# EasyEDA Pro project T113 IoT Station.eprj, board PCB1
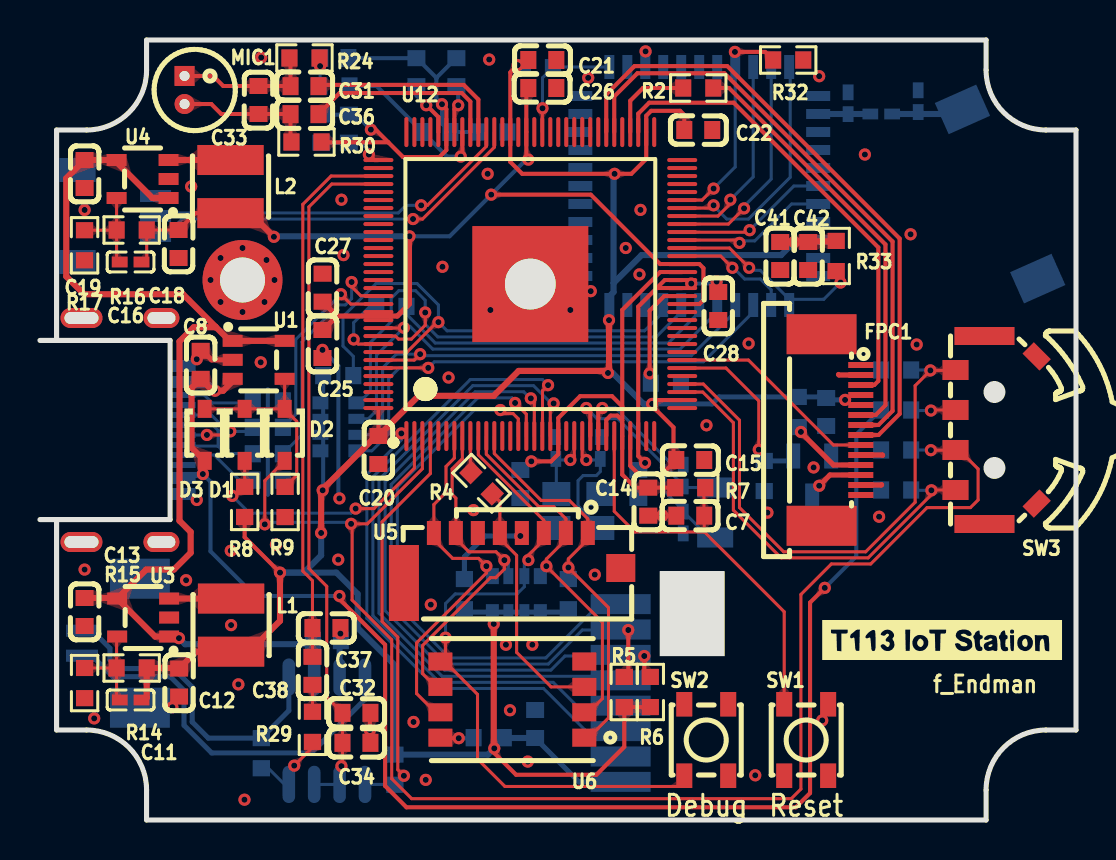
[diagram p3: board, top side]
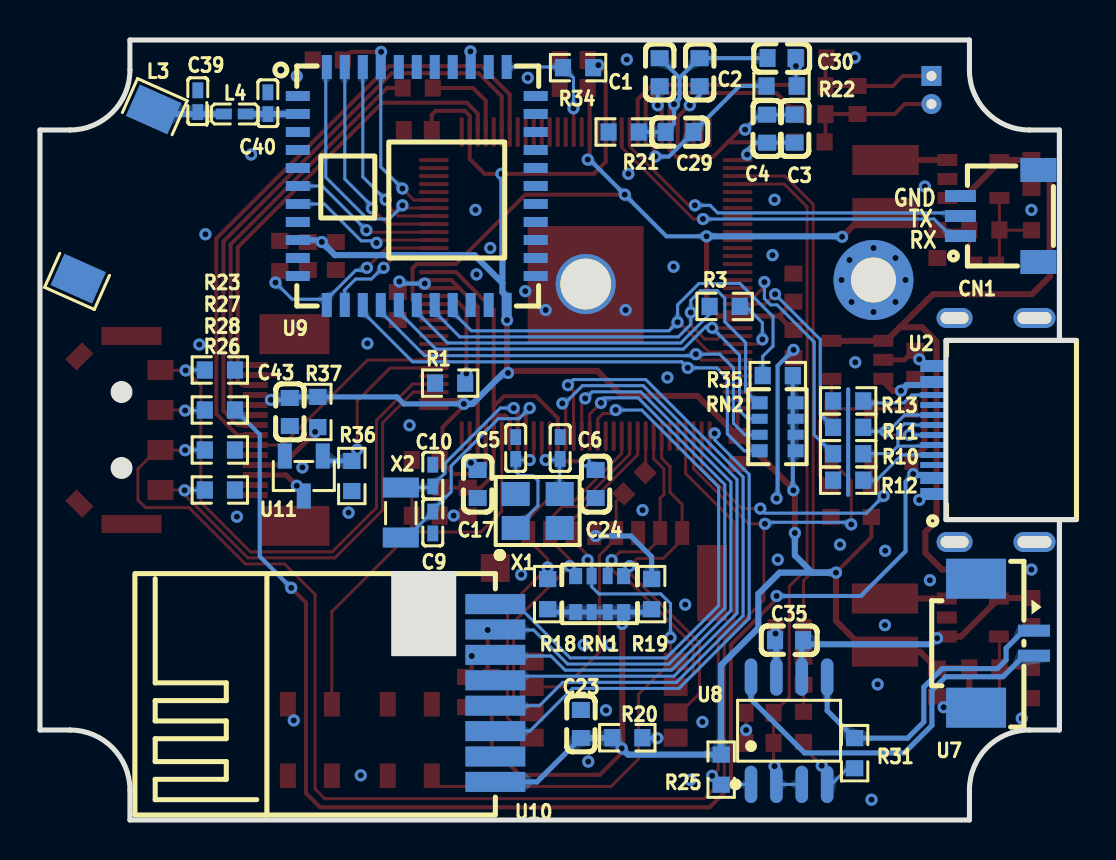
[diagram p4: board, bottom side, seen from below]

Outline 51.83 x 39 mm; copper layers: Top Layer, Bottom Layer. Coordinates in mm from the lower left corner of the outline.
Outline path: 0.83,24 0.83,34.5 2.33,34.5 arc(4.45,35.38) 5.33,37.5 5.33,39 47.33,39 47.33,37.5 arc(48.21,35.38) 50.33,34.5 51.83,34.5 51.83,4.5 50.33,4.5 arc(48.21,3.62) 47.33,1.5 47.33,0 5.33,0 5.33,1.5 arc(4.45,3.62) 2.33,4.5 0.83,4.5 0.83,15
Stack: Top Layer 0.035mm / Dielectric1 1.11mm FR4 er 4.5 / Bottom Layer 0.035mm

## Design rules (mm)
spacing safeClearance (default): track to track 0.152, other pairs 0.076 to 0.3
track width trackWidth (default): min 0.127, default 0.203, max 2.54
track width trackWidthPower: min 0.203, default 0.305, max 2.54
differential pair differentialPair (default): width min 0.127, default 0.254, max 2.54; gap min 0.152, default 0.152
via viaSize (default): diameter min 0.5, default 0.61, max 10; hole min 0.3, default 0.305, max 6
net VCC3.3 uses trackWidthPower
net VCC5 uses trackWidthPower
net VCC5-IN uses trackWidthPower

## Placement (name value [footprint] x y rotation side)
C1  1uF  [C0603]  20.83 37.39 270 bottom
C2  1uF  [C0603]  18.83 37.39 270 bottom
C3  1uF  [C0603]  14.08 34.57 270 bottom
C4  100nF  [C0603]  15.45 34.57 270 bottom
C5  22pF  [C0402]  28.03 18.6 90 bottom
C6  22pF  [C0402]  25.81 18.6 270 bottom
C7  100nF  [C0603]  32.53 15.22 0 top
C8  1uF  [C0603]  8.04 22.76 90 top
C9  22pF  [C0402]  32.18 14.87 270 bottom
C10  22pF  [C0402]  32.18 17.22 90 bottom
C11  22pF  [C0402]  4.53 6 0 top
C12  10uF  [C0603]  6.96 6.87 90 top
C13  10uF  [C0603]  2.23 10.4 270 top
C14  1uF  [C0603]  30.43 15.92 90 top
C15  1uF  [C0603]  32.53 18 180 top
C16  22pF  [C0402]  4.53 27.9 0 top
C17  10uF  [C0603]  29.93 16.8 90 bottom
C18  10uF  [C0603]  6.93 28.8 270 top
C19  10uF  [C0603]  2.23 32.3 270 top
C20  100nF  [C0603]  16.93 18.5 90 top
C21  100nF  [C0603]  25.13 38 180 top
C22  100nF  [C0603]  32.93 34.5 180 top
C23  100nF  [C0603]  24.77 4.8 270 bottom
C24  100nF  [C0603]  24.03 16.8 90 bottom
C25  100nF  [C0603]  14.13 23.8 270 top
C26  100nF  [C0603]  25.13 36.6 0 top
C27  10uF  [C0603]  14.14 26.62 90 top
C28  100nF  [C0603]  33.93 25.7 270 top
C29  1uF  [C0603]  19.83 34.4 0 bottom
C30  10uF  [C0603]  14.73 38.1 0 bottom
C31  100nF  [C0603]  13.23 36.69 180 top
C32  1nF  [C0603]  15.83 5.36 180 top
C33  2.2nF  [C0603]  10.93 36 90 top
C34  1uF  [C0603]  15.83 3.86 180 top
C35  1uF  [C0603]  14.36 8.99 0 bottom
C36  100nF  [C0603]  13.23 35.29 180 top
C37  1nF  [C0603]  14.33 9.6 0 top
C38  100nF  [C0603]  13.63 7.46 270 top
C39  100nF  [C0402]  43.94 35.94 270 bottom
C40  100nF  [C0402]  40.43 35.84 270 bottom
C41  10uF  [C0603]  37.03 28.2 90 top
C42  100nF  [C0603]  38.43 28.2 90 top
C43  100nF  [C0603]  39.33 20.4 270 bottom
CN1  SH1.0-3P  [CONN-SMD_3P-P1.00-L5.0-W5.0]  3.83 30.2 90 bottom
D1  1N5819  [SOD-323_L1.6-W1.3-LS2.7-RD]  10.24 19.26 270 top
D2  1N5819  [SOD-323_L1.6-W1.3-LS2.7-RD]  12.24 19.26 270 top
D3  1N5819  [SOD-323_L1.6-W1.3-LS2.7-RD]  8.24 19.26 270 top
FPC1  14P  [FPC-SMD_14P-P0.50_HDGC_0.5K-AS-14PWB]  40.08 19.5 270 top
L1  2.2uH  [IND-SMD_L3.0-W3.0]  9.56 9.74 270 top
L2  2.2uH  [IND-SMD_L3.0-W3.0]  9.53 31.67 270 top
L3  AN9520-245  [ANT-SMD_L9.5-W2.1]  48.03 31.3 294 bottom
L4  2.2nH  [L0402-RD]  42.09 35.3 180 bottom
MIC1  QSY4015  [MIC-TH_BD4.0-P1.40-D0.3-L]  7.23 36.5 90 top
NOREF  -  [Pad_e11406]  10.13 27 0 top
R1  220R  [R0603]  31.31 21.84 180 bottom
R2  10K  [R0603]  32.93 36.6 180 top
R3  33R  [R0603]  17.58 25.68 180 bottom
R4  33R  [R0603]  22.09 16.84 135 top
R5  47K  [R0603]  29.23 6.4 90 top
R6  47K  [R0603]  30.53 6.4 90 top
R7  10K  [R0603]  32.53 16.62 180 top
R8  10K  [R0603]  10.24 15.9 270 top
R9  200K  [R0603]  12.26 15.9 90 top
R10  90R  [R0603]  11.4 18.31 180 bottom
R11  90R  [R0603]  11.4 19.63 180 bottom
R12  5.1K  [R0603]  11.4 16.99 180 bottom
R13  5.1K  [R0603]  11.4 20.95 0 bottom
R14  150K  [R0603]  4.59 7.6 0 top
R15  33K  [R0603]  2.23 6.85 90 top
R16  100K  [R0603]  4.59 29.5 0 top
R17  200K  [R0603]  2.23 28.74 90 top
R18  47K  [R0603]  26.43 11.29 90 bottom
R19  0R  [R0603]  21.23 11.29 90 bottom
R20  0R  [R0603]  22.45 4.11 0 bottom
R21  0R  [R0603]  22.63 34.4 180 bottom
R22  33R  [R0603]  14.73 36.7 180 bottom
R23  200K  [R0603]  42.83 22.5 0 bottom
R24  1K  [R0603]  13.23 38.1 0 top
R25  10K  [R0603]  17.75 2.52 90 bottom
R26  200K  [R0603]  42.83 16.5 0 bottom
R27  100K  [R0603]  42.83 20.5 180 bottom
R28  200K  [R0603]  42.83 18.5 0 bottom
R29  10K  [R0603]  13.63 4.66 270 top
R30  1K  [R0603]  13.33 33.9 0 top
R31  10K  [R0603]  11.08 3.34 270 bottom
R32  47K  [R0603]  37.43 38 0 top
R33  47K  [R0603]  39.83 28.2 270 top
R34  47K  [R0603]  24.91 37.62 180 bottom
R35  47K  [R0603]  14.92 22.22 0 bottom
R36  10K  [R0603]  36.23 17.2 270 bottom
R37  3R9  [R0603]  37.93 20.4 270 bottom
RN1  47K  [RES-ARRAY-SMD_0603-8P-L3.2-W1.6-BL]  23.83 11.29 180 bottom
RN2  47K  [RES-ARRAY-SMD_0603-8P-L3.2-W1.6-BL]  14.93 19.66 90 bottom
SW1  Reset  [SW-SMD_4P-L3.5-W3.4-P2.20-LS4.2]  38.33 4 90 top
SW2  Debug  [SW-SMD_4P-L3.5-W3.4-P2.20-LS4.2]  33.33 4 270 top
SW3  TM-2023  [SW-SMD_TM-2023-1]  47.83 19.5 270 top
U1  SGM2554AYN5G/TR  [SOT-23-5_L3.0-W1.7-P0.95-LS2.8-BR]  10.94 23.01 180 top
U2  USB-Type-C  [USB-C-SMD_KH-TYPE-C-CB.W-16P]  4.63 19.5 90 bottom
U3  SY8088AAC  [SOT-23-5_L3.0-W1.7-P0.95-LS2.8-BR]  5.16 10.12 0 top
U4  SY8088AAC  [SOT-23-5_L3.0-W1.7-P0.95-LS2.8-BR]  5.13 32.05 0 top
U5  TF-Short-Debug  [TF-SMD_TF-021B-H265-C9900005422]  23.63 13.1 0 top
U6  CSNPxxG  [LGA-8_L8.0-W6.2-TL]  23.63 6.02 180 top
U7  Speaker  [CONN-SMD_2P-P1.25_HANBO_WAFER-125W-2A]  3.55 8.84 270 bottom
U8  FM8002A  [SOP-8_L4.9-W3.9-P1.27-LS6.0-BL]  14.35 4.46 180 bottom
U9  BL-R8723RD2  [WIFIM-SMD_44P-L12.0-W12.0-P0.90]  32.98 31.7 180 bottom
U10  NF-04-MI-2.4G  [WIRELM-SMD_NF-04-MI-2.4G]  29.05 6.35 90 bottom
U11  AO3400  [SOT-23-3_L2.9-W1.3-P1.90-LS2.4-BL-2]  38.63 17.2 0 bottom
U12  -  [eLQFP-128-5.8]  24.53 26.8 0 top
X1  3225-24M  [CRYSTAL-SMD_4P-L3.2-W2.5-BL_SIT8008BI]  26.93 15.45 180 bottom
X2  3215-32.768K  [CRYSTAL-SMD_L3.2-W1.5-FC-135R32.7680KF-A3]  33.78 15.37 270 bottom

## Footprints (pads in the part's own frame, mm; a bottom-side part is the same pattern mirrored in y, then rotated)
ANT-SMD_L9.5-W2.1
  rect 1.71x2.268 smd: 1(-4.63,0) 2(4.63,0)
C0402
  rect 0.79x0.54 smd: 1(-0.545,0) 2(0.545,0)
C0603
  rect 0.8x0.9 smd: 1(-0.7,0) 2(0.7,0)
CONN-SMD_2P-P1.25_HANBO_WAFER-125W-2A
  rect 0.6x1.6 smd: 1(-0.625,1.45) 2(0.625,1.45)
  rect 2x3 smd: 3(3.225,-1.45) 4(-3.225,-1.45)
CONN-SMD_3P-P1.00-L5.0-W5.0
  rect 1.2x1.8 smd: 0(-2.3,-1.95) 0(2.3,-1.95)
  rect 0.6x1.55 smd: 1(-1,1.95) 2(0,1.95) 3(1,1.95)
CRYSTAL-SMD_4P-L3.2-W2.5-BL_SIT8008BI
  rect 1.4x1.2 smd: 1(-1.1,-0.85) 2(1.1,-0.85) 3(1.1,0.85) 4(-1.1,0.85)
CRYSTAL-SMD_L3.2-W1.5-FC-135R32.7680KF-A3
  rect 1x1.8 smd: 1(-1.25,0) 2(1.25,0)
eLQFP-128-5.8
  oval 0.2x1.5 smd: 1(-6.2,-7.599) 2(-5.8,-7.599) 3(-5.4,-7.599) 4(-5,-7.599) 5(-4.6,-7.599) 6(-4.2,-7.599) 7(-3.8,-7.599) 8(-3.4,-7.599) 9(-2.999,-7.599) 10(-2.6,-7.599) 11(-2.2,-7.599) 12(-1.8,-7.599) 13(-1.399,-7.599) 14(-1,-7.599) 15(-0.6,-7.599) 16(-0.2,-7.599) 17(0.2,-7.599) 18(0.6,-7.599) 19(1,-7.599) 20(1.399,-7.599) 21(1.8,-7.599) 22(2.2,-7.599) 23(2.6,-7.599) 24(2.999,-7.599) 25(3.4,-7.599) 26(3.8,-7.599) 27(4.2,-7.599) 28(4.6,-7.599) 29(5,-7.599) 30(5.4,-7.599) 31(5.8,-7.599) 32(6.2,-7.599) 65(6.2,7.599) 66(5.8,7.599) 67(5.4,7.599) 68(5,7.599) 69(4.6,7.599) 70(4.2,7.599) 71(3.8,7.599) 72(3.4,7.599) 73(2.999,7.599) 74(2.6,7.599) 75(2.2,7.599) 76(1.8,7.599) 77(1.399,7.599) 78(1,7.599) 79(0.6,7.599) 80(0.2,7.599) 81(-0.2,7.599) 82(-0.6,7.599) 83(-1,7.599) 84(-1.399,7.599) 85(-1.8,7.599) 86(-2.2,7.599) 87(-2.6,7.599) 88(-2.999,7.599) 89(-3.4,7.599) 90(-3.8,7.599) 91(-4.2,7.599) 92(-4.6,7.599) 93(-5,7.599) 94(-5.4,7.599) 95(-5.8,7.599) 96(-6.2,7.599)
  oval 1.5x0.2 smd: 33(7.599,-6.2) 34(7.599,-5.8) 35(7.599,-5.4) 36(7.599,-5) 37(7.599,-4.6) 38(7.599,-4.2) 39(7.599,-3.8) 40(7.599,-3.4) 41(7.599,-2.999) 42(7.599,-2.6) 43(7.599,-2.2) 44(7.599,-1.8) 45(7.599,-1.399) 46(7.599,-1) 47(7.599,-0.6) 48(7.599,-0.2) 49(7.599,0.2) 50(7.599,0.6) 51(7.599,1) 52(7.599,1.399) 53(7.599,1.8) 54(7.599,2.2) 55(7.599,2.6) 56(7.599,2.999) 57(7.599,3.4) 58(7.599,3.8) 59(7.599,4.2) 60(7.599,4.6) 61(7.599,5) 62(7.599,5.4) 63(7.599,5.8) 64(7.599,6.2) 97(-7.599,6.2) 98(-7.599,5.8) 99(-7.599,5.4) 100(-7.599,5) 101(-7.599,4.6) 102(-7.599,4.2) 103(-7.599,3.8) 104(-7.599,3.4) 105(-7.599,2.999) 106(-7.599,2.6) 107(-7.599,2.2) 108(-7.599,1.8) 109(-7.599,1.399) 110(-7.599,1) 111(-7.599,0.6) 112(-7.599,0.2) 113(-7.599,-0.2) 114(-7.599,-0.6) 115(-7.599,-1) 116(-7.599,-1.399) 117(-7.599,-1.8) 118(-7.599,-2.2) 119(-7.599,-2.6) 120(-7.599,-2.999) 121(-7.599,-3.4) 122(-7.599,-3.8) 123(-7.599,-4.2) 124(-7.599,-4.6) 125(-7.599,-5) 126(-7.599,-5.4) 127(-7.599,-5.8) 128(-7.599,-6.2)
  round 3 hole 2.54: 129(0,0)
  rect 5.8x5.8 smd: 129(0,0)
FPC-SMD_14P-P0.50_HDGC_0.5K-AS-14PWB
  rect 0.3x1.25 smd: 1(-3.25,0.982) 2(-2.75,0.982) 3(-2.25,0.982) 4(-1.75,0.982) 5(-1.25,0.982) 6(-0.75,0.982) 7(-0.25,0.982) 8(0.25,0.982) 9(0.75,0.982) 10(1.25,0.982) 11(1.75,0.982) 12(2.25,0.982) 13(2.75,0.982) 14(3.25,0.982)
  rect 2x3.5 smd: 15(4.79,-0.982) 16(-4.79,-0.982)
IND-SMD_L3.0-W3.0
  rect 1.501x3.32 smd: 1(1.329,0) 2(-1.329,0)
L0402-RD
  rect 0.79x0.54 smd: 1(-0.545,0) 2(0.545,0)
LGA-8_L8.0-W6.2-TL
  rect 1.2x0.9 smd: 1(-3.6,1.905) 2(-3.6,0.635) 3(-3.6,-0.635) 4(-3.6,-1.905) 5(3.6,-1.905) 6(3.6,-0.635) 7(3.6,0.635) 8(3.6,1.905)
MIC-TH_BD4.0-P1.40-D0.3-L
  rect 1.001x1.001 hole 0.5: 1(0.701,0)
  round 1.001 hole 0.5: 2(-0.701,0)
Pad_e11406
  round 4 hole 2.25: 1(0,0)
R0603
  rect 0.806x0.864 smd: 1(-0.753,0) 2(0.753,0)
RES-ARRAY-SMD_0603-8P-L3.2-W1.6-BL
  rect 0.65x0.8 smd: 1(-1.2,-0.9) 4(1.2,-0.9) 5(1.2,0.9) 8(-1.2,0.9)
  rect 0.5x0.8 smd: 2(-0.4,-0.9) 3(0.4,-0.9) 6(0.4,0.9) 7(-0.4,0.9)
SOD-323_L1.6-W1.3-LS2.7-RD
  rect 0.899x0.701 smd: 1(-1.3,0) 2(1.3,0)
SOP-8_L4.9-W3.9-P1.27-LS6.0-BL
  oval 0.63x1.865 smd: 1(-1.905,-2.683) 2(-0.635,-2.683) 3(0.635,-2.683) 4(1.905,-2.683) 5(1.905,2.683) 6(0.635,2.683) 7(-0.635,2.683) 8(-1.905,2.683)
SOT-23-3_L2.9-W1.3-P1.90-LS2.4-BL-2
  rect 0.7x1.25 smd: 1(-0.95,-1) 2(0.95,-1) 3(0,1)
SOT-23-5_L3.0-W1.7-P0.95-LS2.8-BR
  rect 1x0.6 smd: 1(1.3,-0.95) 2(1.3,0) 3(1.3,0.95) 4(-1.3,0.95) 5(-1.3,-0.95)
SW-SMD_4P-L3.5-W3.4-P2.20-LS4.2
  rect 1.224x0.8 smd: 1(-1.788,1.1) 2(1.788,1.1) 3(-1.788,-1.1) 4(1.788,-1.1)
SW-SMD_TM-2023-1
  rect 1x1.3 smd: 1(-3,-2.03) 2(3,-2.03) C(-1,-2.03) T(1,-2.03)
  rect 0.9x3 smd: 3(-4.7,-0.58) 4(4.7,-0.58)
  rect 1.2x0.8 smd rot 135: 5(3.68,2.03)
  rect 1.2x0.8 smd rot 45: 6(-3.68,2.03)
TF-SMD_TF-021B-H265-C9900005422
  rect 0.7x1.2 smd: 1(3.775,1.25) 2(2.675,1.25) 3(1.575,1.25) 4(0.475,1.25) 5(-0.625,1.25) 6(-1.725,1.25) 7(-2.825,1.25) 8(-3.925,1.25)
  rect 1.5x3.8 smd: 9(-5.425,-1.25)
  rect 1.45x1.4 smd: 10(5.425,-0.5)
USB-C-SMD_KH-TYPE-C-CB.W-16P
  oval 1x1.8 hole 0.6x1.4: 17(5.6,1.444) 20(-5.6,1.443)
  oval 1x2.1 hole 0.6x1.7: 18(5.6,-2.557) 19(-5.6,-2.557)
  rect 0.3x1.2 smd: A1(-3.35,2.557) A4(-2.55,2.557) A5(-1.25,2.557) A6(-0.25,2.557) A7(0.25,2.557) A8(1.25,2.557) A9(2.55,2.557) A12(3.35,2.557) B1(3.05,2.557) B4(2.25,2.557) B5(1.75,2.557) B6(0.75,2.557) B7(-0.75,2.557) B8(-1.75,2.557) B9(-2.25,2.557) B12(-3.05,2.557)
WIFIM-SMD_44P-L12.0-W12.0-P0.90
  rect 1.2x0.5 smd: 1(-5.95,4.5) 2(-5.95,3.6) 3(-5.95,2.7) 4(-5.95,1.8) 5(-5.95,0.9) 6(-5.95,0) 7(-5.95,-0.9) 8(-5.95,-1.8) 9(-5.95,-2.7) 10(-5.95,-3.6) 11(-5.95,-4.5) 23(5.95,-4.5) 24(5.95,-3.6) 25(5.95,-2.7) 26(5.95,-1.8) 27(5.95,-0.9) 28(5.95,0) 29(5.95,0.9) 30(5.95,1.8) 31(5.95,2.7) 32(5.95,3.6) 33(5.95,4.5)
  rect 0.5x1.2 smd: 12(-4.5,-5.95) 13(-3.6,-5.95) 14(-2.7,-5.95) 15(-1.8,-5.95) 16(-0.9,-5.95) 17(0,-5.95) 18(0.9,-5.95) 19(1.8,-5.95) 20(2.7,-5.95) 21(3.6,-5.95) 22(4.5,-5.95) 34(4.5,5.95) 35(3.6,5.95) 36(2.7,5.95) 37(1.8,5.95) 38(0.9,5.95) 39(0,5.95) 40(-0.9,5.95) 41(-1.8,5.95) 42(-2.7,5.95) 43(-3.6,5.95) 44(-4.5,5.95)
WIRELM-SMD_NF-04-MI-2.4G
  rect 1x3 smd: 1(-4.445,-0.002) 2(-3.175,-0.002) 3(-1.905,-0.002) 4(-0.635,-0.002) 5(0.635,-0.002) 6(1.905,-0.002) 7(3.175,-0.002) 8(4.445,0.002)

## Nets
As in the schematic, except:
GND: C5.2 C6.1 C7.1 C8.2 C9.2 C10.2 C12.1 C13.2 C14.1 C15.1 C17.1 C18.2 C19.2 C20.1 C21.1 C22.1 C23.1 C24.1 C25.2 C26.2 C27.2 C28.2 C32.1 C34.1 C35.2 C37.2 C39.1 C40.1 C41.1 C42.1 C43.2 CN1.0 CN1.3 FPC1.2 FPC1.10 FPC1.13 FPC1.15 FPC1.16 NOREF.1 R1.1 R9.1 R12.1 R13.2 R15.1 R17.1 R21.1 R23.1 R26.1 R28.1 R32.2 R36.2 SW1.4 SW2.2 U1.2 U2.17 U2.18 U2.19 U2.20 U2.A1 U2.A12 U2.B1 U2.B12 U3.2 U4.2 U5.6 U5.9 U5.10 U6.4 U7.3 U7.4 U8.7 U9.1 U9.3 U9.20 U9.31 U9.33 U9.36 U10.2 U11.2 U12.129 X1.2 X1.4

Pads without a net: FPC1 1 14; L3 2; SW1 1 3; SW2 1 3; SW3 3 4 5 6; U2 A8 B8; U9 4 5 8 10 11 21 23 24 25 26 27 28 29 30 32 35 37 38 39 40; U12 5 6 13 14 31 32 33 37 40 41 42 43 44 45 60 61 62 63 64 65 69 72 73 74 75 76 77 78 80 82 84 93 94 95 96 98 101 102 103 104 105 106 107 108 109 110 111 112 113 124 125 126 127

## Via types
v1: diameter 0.61, hole 0.305, Top Layer to Bottom Layer, 153 vias

## Routing (per net, layer and track width the routed paths; a pad name or vN(x,y) marks a point on that pad's centre or on a via; arc(x,y) is an arc through that point)
AGND: length 23.6
  Top Layer w0.203: 17.43,33.88 16.79,34.52 v1(16.56,34.52) ; 17.43,33.88 18.16,33.15 19.98,33.15 20.33,33.5 U12.91 20.33,35.54 20.11,35.76 v1(20.11,35.79) ; 17.43,33.88 14.1,33.88 R30.2
  Bottom Layer w0.203: 19.83,37.11 19.83,37.09 19.83,37.08 19.83,36.07 v1(20.11,35.79) 20.11,34.82 C29.2 R21.2 ; 19.83,37.11 19.83,37.11 18.85,38.09 C2.1 15.44,38.09 C30.2 ; 19.83,37.11 20.81,38.09 C1.1 ; 16.56,34.52 15.81,35.27 C4.1 C3.1
AVCC1.8: length 8.3
  Top Layer w0.203: v1(21.05,33.17) 21.13,33.25 U12.89
  Bottom Layer w0.203: v1(21.05,33.17) 20.37,33.17 19.14,34.4 C29.1 19.13,34.41 16.84,36.7 R22.1
GND: length 24.3
  Top Layer w0.203: v1(9.03,28.1) 9.63,28.1 v1(10.13,28.6) ; C14.1 31.13,15.22 v1(31.14,15.22) 31.83,15.22 C7.1 ; C32.1 16.5,5.33 v1(16.5,4.5) 16.5,3.89 C34.1
  Top Layer w0.254: U1.2 8.58,23.01 8.14,23.46 C8.2 ; FPC1.13 42.09,16.75 42.11,16.76 ; FPC1.2 39.97,22.25 39.95,22.28 ; 42.16,18.24 42.15,18.25 FPC1.10
  Bottom Layer w0.203: 11.4,16.26 11.4,21.54 ; v1(14.98,16.08) 14.93,16.08 14.88,16.13 14.93,16.18 14.93,22.71 v1(14.13,23.51)
  Bottom Layer w0.305: U8.7 14.99,8.93 C35.2
  vias: v1(2.23,30.5) v1(2.23,12.52) v1(2.71,5.08) v1(6.62,5.64) v1(7.31,11.99) v1(7.56,31.67) v1(7.84,23.04) v1(7.84,16) v1(8.53,27) v1(9.03,25.9) v1(9.54,13.46) v1(9.56,9.74) v1(9.93,6.78) v1(10.13,25.4) v1(10.23,1.02) v1(11.07,38.13) v1(11.04,22.89) v1(11.23,25.9) v1(11.33,28) v1(11.73,27) v1(11.81,13.77) v1(14.92,13.02) v1(15.08,31.01) v1(15.03,9.32) v1(15.18,28.25) v1(18.69,4.9) v1(19.3,2.01) v1(19.55,10.77) v1(20.14,27.66) v1(20.44,22.12) v1(21.69,15.49) v1(22.47,38.02) v1(22.4,32.31) v1(22.53,25.5) v1(23.31,8.76) v1(23.51,5.49) v1(24.4,2.92) v1(24.63,8.76) v1(26.53,25.5) v1(27.43,37.11) v1(27.55,26.44) v1(27.76,12.27) v1(29.31,28.6) v1(30.04,30.51) v1(29.99,27.28) v1(30.3,38.43) v1(33.34,19.74) v1(35.45,23.83) v1(35.78,2.23) v1(36.39,15.37) v1(38.7,17.63) v1(38.98,37.19) v1(39.14,4.98) v1(41.27,33.27) v1(41.98,15.16) v1(43.56,29.29) v1(43.86,23.77)
VCC1.8: length 24.8
  Top Layer w0.203: U12.50 31.02,27.4 29.13,25.5 29.13,20.68 ; 29.13,20.68 28.62,21.19 27.02,21.19 25.93,20.1 U12.20 25.93,18.3 25.57,17.93 v1(24.58,17.93) ; 29.13,20.68 29.13,19.98 ; 29.13,19.98 U12.28 29.13,17.27 29.79,16.61 30.62,16.62 ; 29.13,19.98 28.89,20.22 28.54,20.22 28.33,20 U12.26 ; 30.62,16.62 C14.2 ; 30.62,16.62 R7.2
  Bottom Layer w0.203: v1(24.58,17.93) 24.47,17.93 C24.2
VCC3.3: length 155.9
  Top Layer w0.203: U12.128 16.93,19.18 16.93,19.17 ; R6.1 R5.1 29.23,3.66 27.83,2.26 23.82,2.26 22.73,3.35 v1(22.73,3.58) ; U12.34 30.82,21 v1(30.63,20.8) 30.63,20.7 31.69,19.63 31.69,18.14 C15.2 31.13,17.3 29.94,17.3 29.53,17.71 U12.29 ; C22.2 32.23,35.25 32.03,35.46 30.58,35.46 30.33,35.21 U12.66 30.33,33.05 29.59,32.31 v1(28.75,32.31) 24.12,32.31 23.53,32.9 U12.83 23.53,37.38 v1(23.9,37.74) ; v1(12.01,12.37) 10.24,14.14 R8.2
  Top Layer w0.254: v1(40.28,21.01) 40.36,21.01
  Top Layer w0.305: v1(14.07,14.35) 14.07,16.46 16.78,19.17 16.93,19.17 C20.2 18.94,21.21 22.7,21.21 23.95,22.45 28.32,22.45 v1(28.42,22.35) 28.47,22.4 v1(28.47,24.99) ; 38.42,28.93 39.48,28.93 39.54,28.99 ; 38.42,28.93 38.42,28.92 C42.2 ; 38.42,28.93 38.39,28.9 v1(37.73,28.9) ; 22.7,9.8 22.7,3.61 v1(22.73,3.58) ; 39.55,28.99 39.55,29 ; 39.55,28.99 39.54,28.99 ; 39.55,28.99 39.56,29 39.55,29 ; 39.55,29 39.54,28.99 ; v1(12.01,12.37) 12.01,9.96 10.47,8.42 L1.1 7.8,8.42 C12.2 6.93,7.6 5.34,7.6 5.34,6.11 5.23,6
  Bottom Layer w0.203: R34.2 24.02,37.62 v1(23.9,37.74) ; v1(14.14,16.48) 14.17,16.51 R35.1
  Bottom Layer w0.254: R19.1 21.38,10.39 RN1.4 ; v1(37.73,28.9) 37.83,29 U9.9 ; v1(30.63,20.8) 33.62,20.8 33.97,21.15 R37.1 39.28,21.15 C43.1 39.43,21.01 v1(40.28,21.01) ; RN1.4 22.7,10.32 v1(22.7,9.8) ; RN1.4 RN1.3 RN1.2 RN1.1 26.29,10.39 R18.1 ; C23.2 26.97,1.91 U10.1
  Bottom Layer w0.305: 28.7,26.85 30.09,28.24 37.08,28.24 v1(37.73,28.9) ; 28.7,26.85 28.7,32.26 v1(28.75,32.31) ; 28.7,26.85 28.7,26.39 28.48,26.18 U9.22 ; 12.01,12.37 13.2,12.37 14.07,13.23 v1(14.07,14.35) ; v1(28.42,22.35) 28.65,22.35 30.2,20.8 v1(30.63,20.8) ; v1(12.01,12.37) 14.83,12.37 15.9,11.3 15.9,9.6 17.75,7.74 R25.2 22.42,3.27 v1(22.73,3.58) 22.73,3.64 R20.2 23.22,4.1 C23.2
VCC5: length 55.4
  Top Layer w0.305: U3.4 3.83,11.1 C13.1 ; U3.4 5.76,9.17 U3.1 6.88,9.17 v1(6.95,9.09) ; U3.4 5.31,12.52 6.7,12.52 7.54,13.36 7.54,14.4 6.98,14.96 6.98,23.93 7.69,24.64 8.76,24.64 8.78,24.66 ; 8.78,24.66 9.49,23.96 12.24,23.96 ; 8.78,24.66 7.16,26.29 2.2,26.29 1.32,27.18 1.32,32.08 C19.1 U4.4 3.83,32.89 5.62,31.1 U4.1
  Bottom Layer w0.254: C35.1 13.72,8.93 U8.6
  Bottom Layer w0.305: C35.1 13.45,8.79 7.26,8.79 v1(6.95,9.09)
VCC5-IN: length 75
  Top Layer w0.203: v1(14.98,11.2) 14.98,11.05 17.27,8.76 17.27,1.7 18.33,0.64 37.82,0.64 38.53,1.35 38.53,10.87 v1(39.26,11.61)
  Top Layer w0.305: 8.15,17.48 8.15,17.86 D3.2 7.58,18.61 7.58,21.6 C8.1 8.63,21.46 9.16,21.46 9.64,21.94 U1.3
  Bottom Layer w0.203: v1(8.15,17.3) 8.53,16.92 8.53,13.44 10.76,11.2 v1(14.98,11.2) ; R27.2 42.06,20.5 40.84,19.28 40.84,13.18 v1(39.26,11.61)
  Bottom Layer w0.254: U2.B9 U2.A4
  Bottom Layer w0.305: U2.B9 8.1,17.25 v1(8.15,17.3) ; v1(8.76,21.46) 8.47,21.75 U2.B4 U2.A9
VCC-CORE: length 50.9
  Top Layer w0.152: 5.23,27.9 5.34,28.01 5.34,29.5 C18.1
  Top Layer w0.203: 24.43,36.5 24.33,36.4 U12.81 24.33,33.12 v1(24.43,33.02) ; 9.53,30.34 7.78,30.34 C18.1 ; v1(22.58,31.27) 27.55,31.27 31.02,27.8 U12.51 32.99,27.8 33.19,27.59 33.19,26 32.99,25.8 U12.46
  Top Layer w0.254: v1(18.49,29.18) 18.49,25.81 17.88,25.2 14.86,25.2 ; C25.1 14.16,24.5 14.86,25.2 ; 14.86,25.2 C27.1
  Top Layer w0.305: v1(11.7,29.16) 10.52,30.34 9.53,30.34
  Bottom Layer w0.203: v1(18.49,29.18) 20.49,29.18 v1(22.58,31.27) 24.33,33.02 v1(24.43,33.02)
  Bottom Layer w0.305: v1(18.49,29.18) 11.73,29.18 v1(11.7,29.16)
VCC-DRAM: length 13.8
  Top Layer w0.203: U12.48 30.86,26.6 ; 30.86,26.6 29.93,25.67 U12.30 29.93,18.2 v1(30.27,17.86) ; 30.86,26.6 31.26,27 U12.49
  Bottom Layer w0.203: v1(30.27,17.86) 30.27,17.84 C17.2 ; v1(32.58,26.82) 33.75,26.82 v1(33.85,26.92)
AMP-PA: length 20.6
  Top Layer w0.152: v1(18.21,2.21) 17.9,2.51 17.9,9.14 17.11,9.93 17.11,14.91 19.53,17.33 U12.4
  Bottom Layer w0.152: v1(18.21,2.21) 18.2,2.21 17.75,1.76 17.74,1.78 U8.1
AP_WAKE_BT: length 7.8
  Top Layer w0.152: v1(35.5,29.49) 35.4,29.39 32.14,29.39 U12.55
  Bottom Layer w0.152: v1(35.5,29.49) 37.71,31.7 U9.6
BT-EN: length 6.3
  Top Layer w0.152: v1(25.14,35.59) 25.13,35.58 U12.79
  Bottom Layer w0.152: v1(25.14,35.59) 25.14,37.11 25.65,37.62 R34.1 25.7,37.65 U9.34
BT_WAKE_AP: length 7.7
  Top Layer w0.152: v1(35,28.85) 34.85,29 U12.54
  Bottom Layer w0.152: v1(35,28.85) 35.1,28.96 35.76,28.96 37.6,30.8 U9.7
DXIN: length 6.8
  Top Layer w0.152: U12.23 27.13,18.2 v1(27.33,18)
  Bottom Layer w0.152: X1.1 26.92,15.71 26.92,16.97 27.17,17.22 27.83,17.22 28.03,17.42 28.03,17.9 ; 27.95,17.9 28.03,17.9 ; 28.03,17.9 28.03,18.06 27.98,18 v1(27.33,18)
DXOUT: length 3.6
  Top Layer w0.152: U12.22 26.73,18.2 v1(26.53,18)
  Bottom Layer w0.152: 25.81,17.9 25.83,17.87 X1.3 ; v1(26.53,18) 25.86,18 25.81,18.06
GPIO-POWER-CTL: length 14.1
  Top Layer w0.152: v1(15.79,15.57) 16.71,15.57 18.73,17.59 U12.2 ; 10.24,17.96 10.24,16.66 9.79,16.2 v1(9.62,16.2)
  Bottom Layer w0.152: v1(15.79,15.57) 15.56,15.34 10.48,15.34 v1(9.62,16.2)
HPOUT-FB: length 33.9
  Top Layer w0.152: v1(15.08,2.69) 15.13,2.74 C34.2 C32.2 14.35,6.15 14.35,11.68 13.45,12.57 13.45,30.66 14.6,31.8 U12.100
  Bottom Layer w0.152: U8.2 U8.3
HPOUT-L: length 27.2
  Top Layer w0.152: C38.1 C37.1 13.63,11.97 13.15,12.45 13.15,30.78 14.56,32.2 U12.99
KEY-L: length 27.9
  Top Layer w0.152: SW3.1 45.78,22.48 v1(44.55,22.48) 43.78,21.72 43.78,15.89 41.31,13.41 37.21,13.41 35,15.62 35,19.99 33.19,21.8 U12.36
  Bottom Layer w0.152: R23.2 44.53,22.5 v1(44.55,22.48)
KEY-POWER: length 74.8
  Top Layer w0.152: v1(44.57,18.49) 45.79,18.49 SW3.T 45.98,18.5 46.93,17.55 46.93,16 46.55,15.62 44.38,15.62 41.56,12.8 39.59,12.8 38.07,11.28 38.07,1.55 37.59,1.07 18.59,1.07 17.6,2.06 17.6,9.02 15.62,11 15.62,14.76 v1(15.56,14.81) 16.38,14.81 19.13,17.56 U12.3 ; v1(11.25,14.78) 11.25,16.96 D2.2
  Bottom Layer w0.152: R28.2 44.56,18.5 v1(44.57,18.49) ; v1(11.25,14.78) 11.35,14.88 15.49,14.88 v1(15.56,14.81)
KEY-R: length 22.2
  Top Layer w0.152: SW3.2 44.61,16.5 v1(44.6,16.48) 44.6,16.27 41.43,13.11 37.08,13.11 34.69,15.49 34.69,19.86 33.16,21.4 U12.35
  Bottom Layer w0.152: R26.2 43.6,16.48 v1(44.6,16.48)
LCD-LED-PWM: length 8.5
  Top Layer w0.152: v1(35.96,18.52) 35.96,20.95 34.32,22.6 U12.38
  Bottom Layer w0.254: R36.1 37.44,17.95 U11.1
LCD-RESET: length 10.7
  Top Layer w0.152: FPC1.9 39.69,18.75 35.44,23 U12.39
MIC-N: length 9.7
  Top Layer w0.203: C36.1 14.99,36.35 21.1,36.35 21.53,35.92 U12.88
MIC-P: length 10
  Top Layer w0.203: U12.87 21.93,36.02 21.2,36.75 14,36.75 C31.1
NRF-CE: length 25
  Bottom Layer w0.152: U10.3 27.32,4.44 25.19,6.58 19.86,6.58 16.35,10.09 16.35,17.28 18.08,19.01 v1(18.08,19.33)
NRF-IRQ: length 28
  Top Layer w0.152: v1(23.03,20.5) 23.21,20.32 23.67,20.32 23.93,20.06 U12.15
  Bottom Layer w0.152: 29.05,10.8 28,10.8 25.31,8.1 20.49,8.1 17.88,10.72 17.88,16.65 21.73,20.5 v1(23.03,20.5)
RESET: length 21.2
  Top Layer w0.152: 33.23,14.4 29.76,14.4 28.73,15.43 U12.27 ; 33.23,14.4 C7.2 33.22,15.23 33.22,16.55 R7.1 ; 33.23,14.4 33.24,14.4 37.23,10.41 SW1.2
SDIO0-CLK: length 12.5
  Top Layer w0.152: R4.1 23.01,15.93 U5.5 23.01,14.07 23.85,13.23 23.85,8.38 25.57,6.66 U6.3
SDIO0-CMD: length 33.7
  Top Layer w0.152: v1(20.29,9.12) 20.29,8.19 20.03,7.93 U6.5 20.25,7.92 21.89,6.28 21.89,3.05 23.26,1.68 32,1.68 32.23,1.91 SW2.4 ; v1(24.43,12.99) 24.43,13.24 25.21,14.01 U5.3 25.21,14.98 21.93,18.26 U12.10
  Bottom Layer w0.152: v1(24.43,12.99) 24.23,12.79 RN1.7 24.23,11.67 23.87,11.3 20.77,11.3 20.29,10.82 v1(20.29,9.12)
SDIO0-D0: length 17.9
  Top Layer w0.152: U12.8 21.13,18.06 20.62,17.55 20.62,16.28 20.81,16.09 U5.7 20.81,14.06 21.46,13.41 22.82,13.41 v1(23.23,12.99) 23.23,12.55 22.8,12.12 22.53,12.12 19.15,8.73 19.15,7.31 19.81,6.66 U6.6
  Bottom Layer w0.152: v1(23.23,12.99) 23.43,12.79 RN1.6
SDIO0-D1: length 18.8
  Top Layer w0.152: U6.7 19.78,5.39 18.84,6.32 18.84,8.86 22.33,12.35 v1(22.33,12.69) 21.95,13.08 20.65,13.08 19.71,14.02 U5.8 19.71,15.78 20.31,16.38 20.31,17.68 20.73,18.09 U12.7
  Bottom Layer w0.152: RN1.5 22.63,12.39 v1(22.33,12.69)
SDIO0-D2: length 20.3
  Top Layer w0.152: U12.12 22.73,18.32 25.07,15.98 26.49,15.98 27.41,15.06 U5.1 27.41,14.03 26.44,13.06 v1(26.44,12.62) 28.44,10.62 28.44,5.11 27.45,4.11 U6.1
  Bottom Layer w0.152: 26.43,12.62 v1(26.44,12.62) 26.44,12.05 R18.2
SDIO0-D3: length 18.6
  Top Layer w0.152: U6.2 27.45,5.39 28.14,6.07 28.14,9.89 v1(25.33,12.69) 25.33,13.04 26.31,14.02 U5.2 26.31,15.06 25.7,15.67 24.95,15.67 22.33,18.29 U12.11
  Bottom Layer w0.152: RN1.8 25.03,12.39 v1(25.33,12.69)
SDIO1-CLK: length 16.8
  Bottom Layer w0.152: U9.17 32.98,25.39 31.44,23.85 19.77,23.85 18.33,25.29 18.33,25.86
SDIO1-CMD: length 24.5
  Top Layer w0.152: U12.118 18.19,24.6 v1(18.21,24.61)
  Bottom Layer w0.152: RN2.6 16.42,20.06 16.84,20.47 16.84,23.24 v1(18.21,24.61) 18.28,24.69 18.5,24.69 19.65,23.55 32.02,23.55 33.88,25.4 U9.16
SDIO1-D0: length 26.5
  Top Layer w0.152: U12.119 17.78,24.2 17.94,24.04 18.58,24.04 19.27,24.74 v1(19.27,25.37)
  Bottom Layer w0.152: U9.18 32.08,25.41 30.83,24.16 19.9,24.16 19.27,24.78 v1(19.27,25.37) 19.27,25.98 18.79,26.47 17.95,26.47 17.57,26.09 17.57,24.92 16.53,23.88 16.53,21.44 15.95,20.86 RN2.5
SDIO1-D1: length 25.7
  Top Layer w0.152: v1(19.93,24.89) 19.86,24.89 18.36,23.4 U12.121
  Bottom Layer w0.152: U9.19 31.18,25.4 30.25,24.46 20.37,24.46 v1(19.93,24.89) 19.93,25.75 18.87,26.82 16.81,26.82 15.16,25.17 15.16,23.7 15.68,23.18 R35.2
SDIO1-D2: length 27.2
  Top Layer w0.152: v1(19.43,22.61) 16.94,22.61 U12.123
  Bottom Layer w0.152: RN2.8 16.6,18.46 17.44,19.3 17.44,22.07 17.98,22.61 v1(19.43,22.61) 19.73,22.91 33.19,22.91 35.68,25.4 U9.14
SDIO1-D3: length 25.8
  Top Layer w0.152: v1(19.02,23.29) 18.72,23 U12.122
  Bottom Layer w0.152: 19.1,23.22 19.12,23.19 ; 19.1,23.22 32.58,23.22 34.78,25.42 U9.15 ; 19.1,23.22 v1(19.02,23.29) 17.83,23.29 17.14,22.61 17.14,19.84 16.56,19.26 RN2.7
SPI0-CS: length 34.8
  Top Layer w0.152: U12.18 25.14,19.21 25.14,21.46 v1(25.42,21.74)
  Bottom Layer w0.152: v1(25.42,21.74) 25.14,22.02 21.53,22.02 16.66,17.15 16.66,10.21 19.99,6.88 25.67,6.88 26.84,5.72 29.05,5.72
SPI0-MISO: length 32.4
  Top Layer w0.152: v1(23.77,20.85) 24.33,20.29 U12.16
  Top Layer w0.203: v1(29.43,9.5) 29.43,7.35 R5.2
  Bottom Layer w0.152: v1(29.43,9.5) 27.13,9.5 25.43,7.8 20.37,7.8 17.57,10.59 17.57,16.77 21.91,21.11 23.62,21.11 23.77,20.95 v1(23.77,20.85)
SPI0-MOSI: length 33.3
  Top Layer w0.152: U12.17 24.73,20.91 v1(24.56,21.08)
  Top Layer w0.203: v1(30.23,8.2) 30.23,7.45 R6.2
  Bottom Layer w0.152: v1(24.56,21.08) 24.53,21.08 24.2,21.41 21.78,21.41 17.27,16.9 17.27,10.47 20.24,7.49 25.56,7.49 26.26,8.2 v1(30.23,8.2)
SPI0-SCK: length 32.9
  Top Layer w0.152: v1(25.7,20.83) 25.53,20.66 U12.19
  Bottom Layer w0.152: U10.5 28.85,7.19 20.11,7.19 16.96,10.34 16.96,17.03 21.65,21.72 24.69,21.72 25.58,20.83 v1(25.7,20.83)
SPI1-DBI-CS: length 23.8
  Top Layer w0.203: FPC1.3 41.74,21.75 41.94,21.95 41.94,28.63 34.71,35.86 30.48,35.86 29.93,35.32 U12.67
SPI1-DBI-DC: length 31.9
  Top Layer w0.203: FPC1.8 41.95,19.25 43.01,20.31 43.01,29.07 34.39,37.69 29.74,37.69 28.33,36.28 U12.71
SPI1-DBI-SCLK: length 21.3
  Top Layer w0.203: FPC1.6 41.81,20.25 42.3,20.74 42.3,28.78 34.47,36.6 33.69,36.6
SPI1-DBI-SDA: length 30
  Top Layer w0.203: U12.70 28.73,36.18 29.89,37.34 34.24,37.34 42.65,28.92 42.65,20.45 41.95,19.75 FPC1.7
UART2-CTX: length 11.2
  Top Layer w0.152: U12.59 33.13,31 v1(33.7,31.57)
  Top Layer w0.203: R32.1 36.27,38.41 v1(34.77,38.41)
  Bottom Layer w0.152: v1(33.7,31.57) 34.78,32.65 U9.41 34.78,38.39 v1(34.77,38.41)
UART2-RTX: length 12.2
  Top Layer w0.152: U12.58 33.56,30.6 v1(33.7,30.73)
  Bottom Layer w0.152: U9.44 37.54,37.6 37.54,32.14 35.45,30.05 34.36,30.05 33.7,30.71 v1(33.7,30.73)
UART2-RX: length 10
  Top Layer w0.152: U12.57 33.92,30.2 34.54,30.82 v1(34.54,31.01)
  Bottom Layer w0.152: U9.42 35.68,32.16 v1(34.54,31.01)
UART2-TX: length 11
  Top Layer w0.152: U12.56 34.44,29.8 v1(35.22,30.58)
  Bottom Layer w0.152: v1(35.22,30.58) 35.22,30.69 36.58,32.05 U9.43
UART4-RX: length 19.5
  Top Layer w0.152: v1(18.66,30.05) 19.14,30.05 22.73,33.64 U12.85
  Bottom Layer w0.152: v1(18.66,30.05) 7.11,30.05 6.26,29.2 CN1.1
UART4-TX: length 18.7
  Top Layer w0.152: v1(19.07,30.73) 19.38,30.73 22.33,33.68 U12.86
  Bottom Layer w0.152: v1(19.07,30.73) 18.31,30.73 17.93,30.35 5.94,30.35 CN1.2
USB0-DM: length 12
  Top Layer w0.152: v1(15.59,26.9) 15.59,26.67 16.05,26.21 16.92,26.21 U12.114
  Bottom Layer w0.152: v1(15.59,26.9) 15.59,26.07 15.28,25.76 14.95,25.76 13.1,23.9 13.1,19.26 R10.1
USB0-DP: length 9.9
  Top Layer w0.152: U12.115 15.55,25.8 v1(15.06,26.29)
  Bottom Layer w0.152: R11.1 12.8,20.28 12.8,24.03 v1(15.06,26.29)
USBC-DM: length 6.3
  Bottom Layer w0.152: U2.B7 7.25,18.69 8.91,18.69 ; 8.91,18.69 8.91,19.48 8.58,19.81 8.1,19.81 8.04,19.75 U2.A7 ; 8.91,18.69 9.28,18.32 10.62,18.32
USBC-DP: length 6.3
  Top Layer w0.152: v1(9.52,19.43) 9.34,19.25 v1(8.35,19.25)
  Top Layer w0.254: v1(8.35,19.25) 8.35,19.23 8.33,19.2
  Bottom Layer w0.152: v1(8.35,19.25) 8.35,19.25 U2.A6 ; 10.43,19.43 v1(9.52,19.43) 9.39,19.43 8.57,20.25 U2.B6
  Bottom Layer w0.203: 10.43,19.43 10.62,19.62
WL-EN: length 10.3
  Top Layer w0.152: R33.2 40.05,27.23 v1(40.05,26.87) ; v1(35.48,27.61) 35.48,27.62 34.5,28.6 U12.53
  Bottom Layer w0.152: v1(35.48,27.61) 35.61,27.48 36.04,27.48 37.48,26.04 ; 37.48,26.04 U9.12 ; 37.48,26.04 39.21,26.04 v1(40.05,26.87)
WL-WAKE-AP: length 5.9
  Top Layer w0.152: v1(34.64,27.61) 34.05,28.2 U12.52
  Bottom Layer w0.152: v1(34.64,27.61) 34.69,27.61 35.25,27.05 36.04,27.05 36.58,26.51 U9.13
X32KIN: length 9.1
  Top Layer w0.203: U12.25 27.93,20.4 v1(28.13,20.6)
  Bottom Layer w0.152: X2.1 32.23,16.62 32.18,16.67 32.18,16.73 31.57,17.35 31.57,17.83 28.8,20.6 v1(28.13,20.6)
X32KOUT: length 11.4
  Top Layer w0.203: U12.24 27.53,20.4 v1(27.33,20.6)
  Bottom Layer w0.152: X2.2 33.48,14.12 C9.1 32.18,15.49 31.26,16.41 31.26,17.7 28.9,20.07 27.87,20.07 v1(27.33,20.6)
$1N4762: length 5.5
  Top Layer w0.203: U12.47 31.23,26.2 30.5,25.47 30.5,22.53 30.53,22.5 30.53,22.35 v1(30.5,22.33)
  Bottom Layer w0.203: v1(30.5,22.33) 30.5,22.06 30.56,22
$1N8912: length 2.8
  Top Layer w0.203: v1(19.32,35.74) 19.34,35.74 19.93,35.15 U12.92
  Bottom Layer w0.203: v1(19.32,35.74) 18.83,36.23 C2.2
$1N8913: length 2.4
  Top Layer w0.203: v1(20.92,35.74) 20.73,35.55 U12.90
  Bottom Layer w0.203: v1(20.92,35.74) 20.92,36.6 C1.2
$1N9421: length 3.3
  Top Layer w0.203: v1(16.45,33.27) 16.73,33 U12.97
  Bottom Layer w0.203: v1(16.45,33.27) 16.45,33.48 16.06,33.87 C4.2 C3.2
$1N13284: length 1.8
  Top Layer w0.152: U12.9 21.53,17.48 21.61,17.4
$1N13383: length 3.6
  Top Layer w0.152: U12.120 15.92,23.8 v1(15.69,24.03)
  Bottom Layer w0.152: R3.2 16.5,25.68 15.69,24.87 v1(15.69,24.03)
$1N18420: length 4.5
  Top Layer w0.203: U12.68 29.53,35.96 30.17,36.6 R2.2
$2N4943: length 3.1
  Top Layer w0.305: U3.3 L1.2
$2N5364: length 3.1
  Top Layer w0.305: U4.3 L2.2
$2N7619: length 4.8
  Top Layer w0.152: 3.83,6 R14.1 ; R14.1 R15.2 ; R14.1 3.83,9.14 U3.5
$2N8291: length 4.8
  Top Layer w0.152: R17.2 3.82,29.49 R16.1 ; 3.83,27.9 R16.1 ; R16.1 U4.5
$2N10930: length 9.9
  Top Layer w0.152: D3.1 D1.1 12.22,20.56 ; 12.22,20.56 12.84,19.93 12.84,17.24 R9.2 ; 12.22,20.56 D2.1 12.24,22.06
$2N17491: length 4
  Bottom Layer w0.152: U2.A5 8.72,18.25 9.98,16.99 R12.2
$2N17494: length 3.7
  Bottom Layer w0.152: U2.B5 8.22,21.25 8.61,20.85 10.54,20.85 R13.1
$2N17497: length 4.9
  Top Layer w0.152: v1(24.03,14.2) 24.11,14.27 24.11,14.77
  Bottom Layer w0.254: R19.2 21.23,13.16 22.27,14.2 v1(24.03,14.2)
$2N17518: length 1.7
  Top Layer w0.203: U6.8 20.06,4.09 v1(20.95,4.09)
  Bottom Layer w0.203: R20.1 21.67,4.09 v1(20.95,4.09)
$3N5065: length 2.2
  Top Layer w0.152: SW3.C 44.6,20.5 v1(44.57,20.47)
  Bottom Layer w0.152: v1(44.57,20.47) 43.61,20.47 R27.1
$3N6722: length 3
  Top Layer w0.254: FPC1.12 39.52,17.25 v1(38.98,16.71)
  Bottom Layer w0.254: U11.3 38.63,16.36 v1(38.98,16.71)
$3N6869: length 4
  Top Layer w0.254: v1(38.07,19.41) 38.07,19.38 39.7,17.75 FPC1.11
  Bottom Layer w0.254: v1(38.07,19.41) 38.07,19.51 R37.2
$3N8494: length 6.9
  Top Layer w0.203: R24.1 12.53,38.05 C31.2 12.53,36.7 C33.2 9.17,36.7 8.67,37.2 MIC1.1
$3N8509: length 6.9
  Top Layer w0.203: MIC1.2 8.57,35.8 9.07,35.3 C33.1 12.53,35.3 C36.2 12.53,33.95 R30.1
$3N9217: length 1.8
  Top Layer w0.152: R24.2 13.99,37.72 v1(14.02,37.69)
  Bottom Layer w0.152: C30.1 14.03,37.71 v1(14.02,37.69) 14.02,36.74 R22.2
$3N11166: length 4.3
  Top Layer w0.152: v1(12.72,2.72) 13.63,3.63 R29.2
  Bottom Layer w0.152: R31.2 11.43,2.59 12.23,1.78 U8.4 12.45,2.45 v1(12.72,2.72)
$3N11367: length 1.3
  Top Layer w0.152: C38.2 R29.1
$3N11510: length 16.2
  Bottom Layer w0.254: U7.1 2.62,9.46 3.5,8.58 3.5,8 3.93,7.57 6.69,7.57 7.61,6.64 7.61,4.9 8.42,4.09 R31.1 12.45,5.47 U8.5
$3N11645: length 19.4
  Bottom Layer w0.254: U7.2 2.6,8.21 3.65,7.16 6.52,7.16 7.21,6.48 7.21,4.73 8.59,3.35 13.58,3.35 16.26,6.03 U8.8
$3N14490: length 2.6
  Bottom Layer w0.305: U9.2 41.53,35.3
$3N14921: length 3.3
  Bottom Layer w0.305: 45.91,35.3 L4.1

## Copper pours and planes (outline as drawn; the poured copper is in the pictures)
GND on Top Layer: 0.83,39 51.83,39 51.83,0 0.83,0
GND on Bottom Layer: 0.83,39 51.83,39 51.83,0 0.83,0

Small or netless copper shapes (teardrops, artwork), in the pictures only: 304 on Top Layer, 253 on Bottom Layer

## Text on the board
Bottom Silkscreen Layer: RX | TX | GND
Top Silkscreen Layer: f_Endman | Debug | Reset
